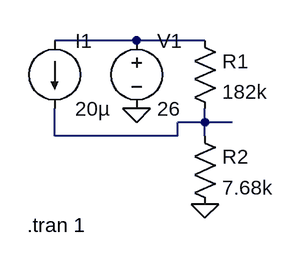
[diagram p0: schematic imonsim.asc]
imonsim.asc, the LTspice schematic file:
Version 4
SHEET 1 880 680
WIRE 320 80 224 80
WIRE 400 80 320 80
WIRE 400 176 400 160
WIRE 400 176 368 176
WIRE 432 176 400 176
WIRE 224 192 224 160
WIRE 368 192 368 176
WIRE 368 192 224 192
WIRE 400 192 400 176
FLAG 320 160 0
FLAG 400 272 0
SYMBOL current 224 80 R0
WINDOW 123 0 0 Left 0
WINDOW 39 0 0 Left 0
SYMATTR InstName I1
SYMATTR Value 20µ
SYMBOL res 384 64 R0
SYMATTR InstName R1
SYMATTR Value 182k
SYMBOL res 384 176 R0
SYMATTR InstName R2
SYMATTR Value 7.68k
SYMBOL voltage 320 64 R0
WINDOW 123 0 0 Left 0
WINDOW 39 0 0 Left 0
SYMATTR InstName V1
SYMATTR Value 26
TEXT 192 296 Left 2 !.tran 1

The netlist it stands for:
* imonsim.asc
I1 N001 N002 20µ
R1 N001 N002 182k
R2 N002 0 7.68k
V1 N001 0 26
.tran 1
.backanno
.end